# EAGLE design logic_probe-v1.0a (EAGLE 4.15)
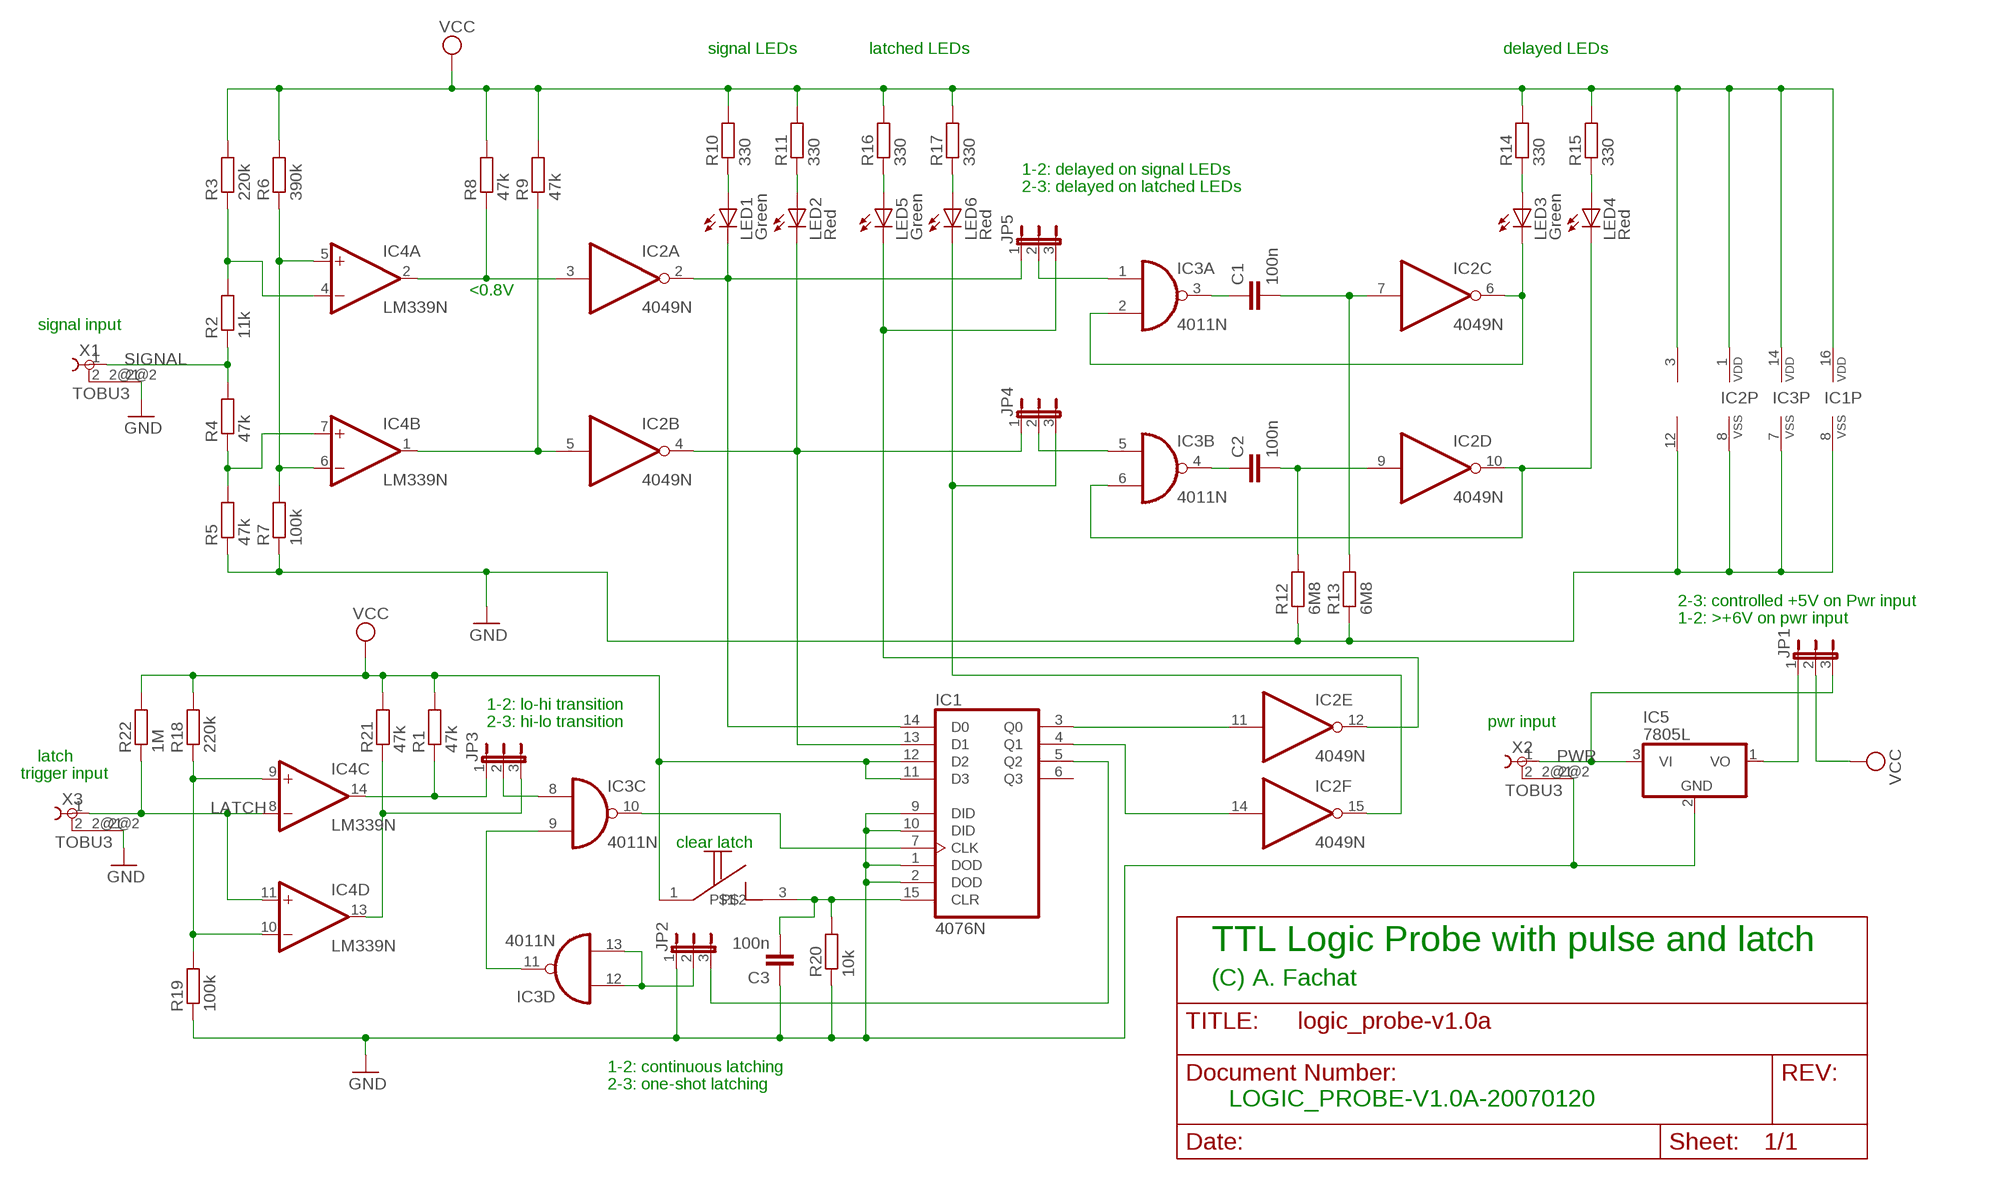
[diagram p0: schematic, sheet 1]

## Parts
C1  100n  C-EU050-025X075  [C050-025X075]
C2  100n  C-EU050-025X075  [C050-025X075]
C3  100n  C-EU050-025X075  [C050-025X075]
IC1  4076N  [DIL16]
IC2  4049N  [DIL16]
IC3  4011N  [DIL14]
IC4  LM339N  [DIL14]
IC5  7805L  [TO92]
JP1  JP2E  [JP2]
JP2  JP2E  [JP2]
JP3  JP2E  [JP2]
JP4  JP2E  [JP2]
JP5  JP2E  [JP2]
LED1  Green  LED3MM  [LED3MM]
LED2  Red  LED3MM  [LED3MM]
LED3  Green  LED3MM  [LED3MM]
LED4  Red  LED3MM  [LED3MM]
LED5  Green  LED3MM  [LED3MM]
LED6  Red  LED3MM  [LED3MM]
R1  47k  R-EU_0207/7  [0207/7]
R2  11k  R-EU_0207/7  [0207/7]
R3  220k  R-EU_0207/7  [0207/7]
R4  47k  R-EU_0207/7  [0207/7]
R5  47k  R-EU_0207/7  [0207/7]
R6  390k  R-EU_0207/7  [0207/7]
R7  100k  R-EU_0207/7  [0207/7]
R8  47k  R-EU_0207/7  [0207/7]
R9  47k  R-EU_0207/7  [0207/7]
R10  330  R-EU_0207/7  [0207/7]
R11  330  R-EU_0207/7  [0207/7]
R12  6M8  R-EU_0207/7  [0207/7]
R13  6M8  R-EU_0207/7  [0207/7]
R14  330  R-EU_0207/7  [0207/7]
R15  330  R-EU_0207/7  [0207/7]
R16  330  R-EU_0207/7  [0207/7]
R17  330  R-EU_0207/7  [0207/7]
R18  220k  R-EU_0207/7  [0207/7]
R19  100k  R-EU_0207/7  [0207/7]
R20  10k  R-EU_0207/7  [0207/7]
R21  47k  R-EU_0207/7  [0207/7]
R22  1M  R-EU_0207/7  [0207/7]
U$3  TASTER  [TASTER]
X1  TOBU3  [TOBU3]
X2  TOBU3  [TOBU3]
X3  TOBU3  [TOBU3]

## Nets
GND: C3.1 IC1.1(DOD) IC1.2(DOD) IC1.8(VSS) IC1.9(DID) IC1.10(DID) IC2.8(P:VSS) IC3.7(P:VSS) IC4.12(P:GND) IC5.2(GND) JP2.1 R5.1 R7.1 R12.1 R13.1 R19.1 R20.1 X1.2@2 X2.2@2 X3.2@2
LATCH: IC4.8(C:-IN) IC4.11(D:+IN) R22.1 X3.1
N$1: C1.2 IC2.7(C:I) R13.2
N$2: IC4.4(A:-IN) R2.2 R3.1
N$4: IC4.7(B:+IN) R4.1 R5.2
N$5: IC4.5(A:+IN) IC4.6(B:-IN) R6.1 R7.2
N$6: C2.2 IC2.9(D:I) R12.2
N$7: IC2.3(A:I) IC4.2(A:OUT) R8.1
N$8: IC2.5(B:I) IC4.1(B:OUT) R9.1
N$9: IC1.14(D0) IC2.2(A:O) JP5.1 LED1.K(C)
N$10: IC1.13(D1) IC2.4(B:O) JP4.1 LED2.K(C)
N$11: LED1.A R10.1
N$12: LED2.A R11.1
N$13: C1.1 IC3.3(A:O)
N$14: C2.1 IC3.4(B:O)
N$15: IC2.6(C:O) IC3.2(A:I1) LED3.K(C)
N$16: IC2.10(D:O) IC3.6(B:I1) LED4.K(C)
N$17: LED3.A R14.1
N$18: LED4.A R15.1
N$19: IC4.13(D:OUT) JP3.3 R21.1
N$20: LED5.A R16.1
N$21: LED6.A R17.1
N$22: IC1.4(Q1) IC2.14(F:I)
N$23: IC2.15(F:O) JP4.3 LED6.K(C)
N$24: IC2.12(E:O) JP5.3 LED5.K(C)
N$25: IC1.3(Q0) IC2.11(E:I)
N$26: IC4.9(C:+IN) IC4.10(D:-IN) R18.1 R19.2
N$28: IC4.14(C:OUT) JP3.1 R1.1
N$29: IC1.7(CLK) IC3.10(C:O)
N$30: IC3.1(A:I0) JP5.2
N$31: C3.2 IC1.15(CLR) R20.2 U$3.3
N$32: IC1.5(Q2) JP2.3
N$33: IC3.12(D:I0) IC3.13(D:I1) JP2.2
N$34: IC3.9(C:I1) IC3.11(D:O)
N$36: IC5.1(VO) JP1.1
N$37: IC3.8(C:I0) JP3.2
N$38: IC3.5(B:I0) JP4.2
PWR: IC5.3(VI) JP1.3 X2.1
SIGNAL: R2.1 R4.2 X1.1
VCC: IC1.11(D3) IC1.12(D2) IC1.16(VDD) IC2.1(P:VDD) IC3.14(P:VDD) IC4.3(P:V+) JP1.2 R1.2 R3.2 R6.2 R8.2 R9.2 R10.2 R11.2 R14.2 R15.2 R16.2 R17.2 R18.2 R21.2 R22.2 U$3.1
Unconnected: IC1.6(Q3) X1.2 X1.2@1 X2.2 X2.2@1 X3.2 X3.2@1

## Notes on the sheet
- signal LEDs | latched LEDs | delayed LEDs
- 1-2: delayed on signal LEDs
- 2-3: delayed on latched LEDs
- <0.8V
- signal input
- 2-3: controlled +5V on Pwr input
- 1-2: >+6V on pwr input
- 1-2: lo-hi transition
- 2-3: hi-lo transition | pwr input
- latch
- trigger input
- clear latch
- TTL Logic Probe with pulse and latch
- (C) A. Fachat
- 1-2: continuous latching
- 2-3: one-shot latching
- LOGIC_PROBE-V1.0A-20070120

## Library data of the parts
C1-C3 = rcl:C-EU: CAPACITOR, European symbol
IC1 = 40xx:4076: Quad D-type REGISTER
IC2 = 40xx:4049: Hex inverting BUFFER
IC3 = 40xx:4011: Quad 2-input NAND
IC4 = linear:LM339: Low Power Low Offset Voltage Quad Comparators with open collector; LM139/LM239/LM339/LM2901/LM3302
IC5 = linear:78*: Positive VOLTAGE REGULATOR Source: http://cache.national.com/ds/LM/LM78L05.pdf http://www.fairchildsemi.com/ds/LM/LM7805.pdf
JP1-JP5 = jumper:JP2E: JUMPER
LED1-LED6 = led:LED: LED OSRAM: - CHIPLED LG R971, LG N971, LY N971, LG Q971, LY Q971, LO R971, LY R971 LH N974, LH R974 LS Q976, LO Q976, LY Q976 LO Q996 - Hyper CHIPLED LW Q18S LB Q993, LB Q99A, LB R99A - SideLED LS A670, LO A670, LY A670, LG A670, LP A670 LB A673, LV A673, LT A673, LW A673 LH A674 LY A675 LS A676, LA A676, LO A676, LY A676, LW A676 LS A679, LY A679, LG A679 - Hyper Micro SIDELED® LS Y876, LA Y876, LO Y876, LY Y876 LT Y87S - SmartLED LW L88C, LW L88S LB L89C, LB L89S, LG L890 LS L89K, LO L89K, LY L89K LS L896, LA L896, LO L896, LY L896 - TOPLED LS T670, LO T670, LY T670, LG T670, LP T670 LSG T670, LSP T670, LSY T670, LOP T670, LYG T670 LG T671, LOG T671, LSG T671 LB T673, LV T673, LT T673, LW T673 LH T674 LS T676, LA T676, LO T676, LY T676, LB T676, LH T676, LSB T676, LW T676 LB T67C, LV T67C, LT T67C, LS T67K, LO T67K, LY T67K, LW E67C LS E67B, LA E67B, LO E67B, LY E67B, LB E67C, LV E67C, LT E67C LW T67C LS T679, LY T679, LG T679 LS T770, LO T770, LY T770, LG T770, LP T770 LB T773, LV T773, LT T773, LW T773 LH T774 LS E675, LA E675, LY E675, LS T675 LS T776, LA T776, LO T776, LY T776, LB T776 LHGB T686 LT T68C, LB T68C - Hyper Mini TOPLED® LB M676 - Mini TOPLED Santana® LG M470 LS M47K, LO M47K, LY M47K Source: http://www.osram.convergy.de/
R1-R22 = rcl:R-EU_: RESISTOR, European symbol
U$3 = csa:TASTER
X1-X3 = con-hirschmann:TOBU3: Female Cinch CONNECTOR

## Board
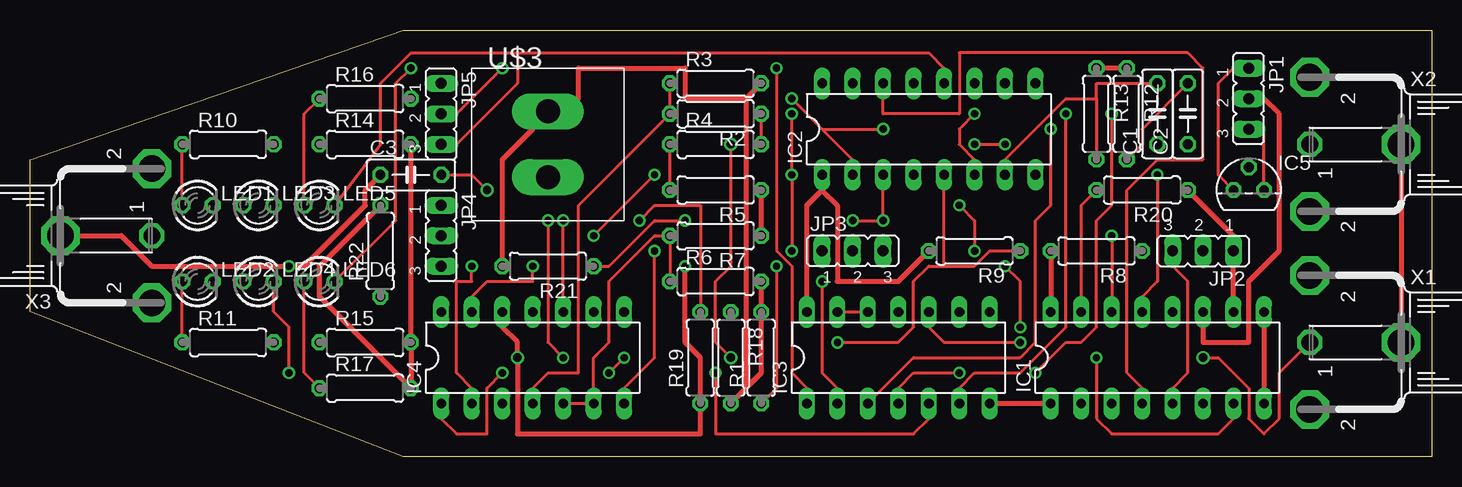
[diagram p1: board, top side]
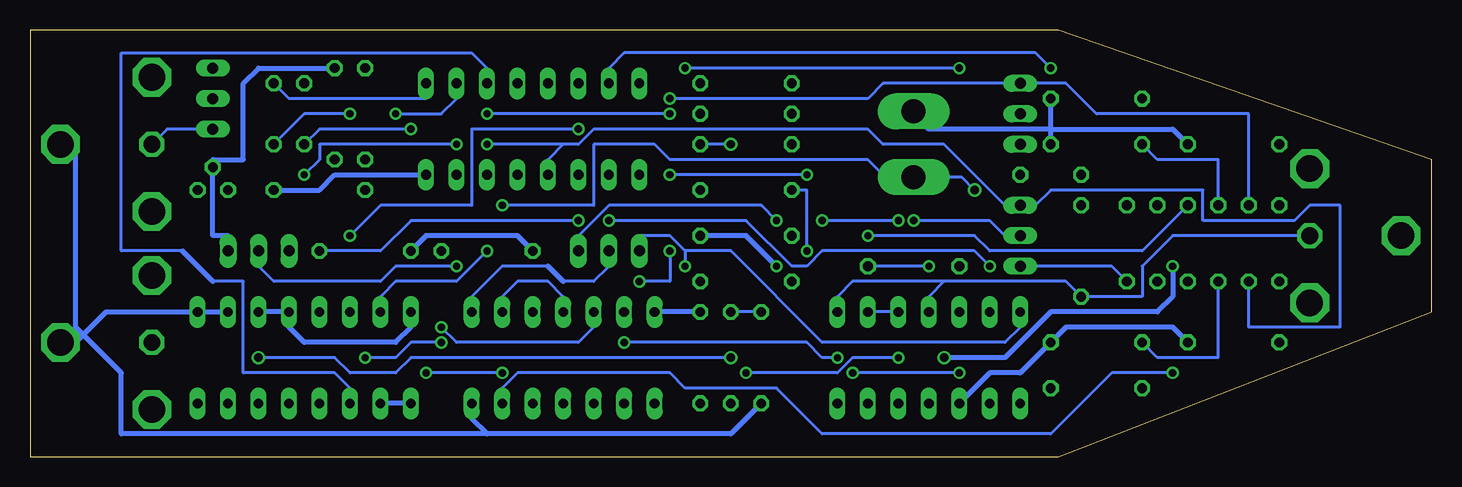
[diagram p2: board, bottom side, seen from below]

Size 116.84 x 35.56 mm. Coordinates in mm from the lower left corner, seen from the top.
Outline: 0,24.77 31.11,35.56 116.84,35.56 116.84,0 31.11,0 0,12.06 0,24.77
Copper layers (1*16): Top 0.035mm / dielectric 1.5mm / Bottom 0.035mm
Design rules "default": minimum track width 10mil, minimum drill 24mil, track to track 8mil, track to pad 8mil, pad to pad 8mil, via to via 8mil, smd to smd 8mil, copper to edge 40mil, drill to drill 8mil, minimum pad ring 10mil, minimum via ring 8mil, stop-mask expansion 4mil, vias tented up to drill 0mil, thermal gap 10mil

### Footprints (pad centres in the part's own frame; a part is rotated, then mirrored left to right if it is on the bottom)
C050-025X075 = drill 0.813 octagon: 1 -2.54,0; 2 2.54,0
DIL16 = drill 0.813 long: 1 -8.89,-3.81; 2 -6.35,-3.81; 3 -3.81,-3.81; 4 -1.27,-3.81; 5 1.27,-3.81; 6 3.81,-3.81; 7 6.35,-3.81; 8 8.89,-3.81; 9 8.89,3.81; 10 6.35,3.81; 11 3.81,3.81; 12 1.27,3.81; 13 -1.27,3.81; 14 -3.81,3.81; 15 -6.35,3.81; 16 -8.89,3.81
DIL14 = drill 0.813 long: 1 -7.62,-3.81; 2 -5.08,-3.81; 3 -2.54,-3.81; 4 0,-3.81; 5 2.54,-3.81; 6 5.08,-3.81; 7 7.62,-3.81; 8 7.62,3.81; 9 5.08,3.81; 10 2.54,3.81; 11 0,3.81; 12 -2.54,3.81; 13 -5.08,3.81; 14 -7.62,3.81
TO92 = drill 0.813 octagon: 1 -1.27,0; 2 0,1.905; 3 1.27,0
JP2 = drill 0.914 long: 1 -2.54,0; 2 0,0; 3 2.54,0
LED3MM = drill 0.813 octagon: A -1.27,0; K 1.27,0
0207/7 = drill 0.813 octagon: 1 -3.81,0; 2 3.81,0
TASTER = drill 2.007 long: 1 0,4.013; 3 0,-1.473
TOBU3 = drill 1.397 octagon: 1 0,-2.54 | drill 2.21 octagon: 2 5.588,-2.54; 2@1 -5.588,-2.54; 2@2 0,5.08

### Placement (x,y rotation side)
C1  93.98,28.58 90 top
C2  96.52,28.58 90 top
C3  31.75,23.5 0 top
IC1  93.98,8.26 0 top
IC2  74.93,27.3 0 top
IC3  72.39,8.26 0 top
IC4  41.91,8.26 0 top
IC5  101.6,22.23 0 top
JP1  101.6,29.84 270 top
JP2  97.79,17.15 180 top
JP3  68.58,17.15 0 top
JP4  34.29,18.41 270 top
JP5  34.29,28.58 270 top
LED1  13.97,20.95 0 top
LED2  13.97,14.6 0 top
LED3  19.05,20.95 0 top
LED4  19.05,14.6 0 top
LED5  24.13,20.95 0 top
LED6  24.13,14.6 0 top
R1  60.96,8.26 90 top
R2  57.15,28.58 180 top
R3  57.15,31.12 0 top
R4  57.15,26.04 0 top
R5  57.15,22.23 180 top
R6  57.15,14.6 0 top
R7  57.15,18.41 180 top
R8  88.9,17.15 180 top
R9  78.74,17.15 180 top
R10  16.51,26.04 0 top
R11  16.51,9.53 0 top
R12  91.44,28.58 270 top
R13  88.9,28.58 270 top
R14  27.94,26.04 0 top
R15  27.94,9.53 0 top
R16  27.94,29.84 0 top
R17  27.94,5.71 0 top
R18  58.42,8.26 270 top
R19  55.88,8.26 90 top
R20  92.71,22.23 180 top
R21  43.18,15.87 180 top
R22  29.21,17.15 90 top
U$3  43.18,24.77 0 top
X1  109.22,9.53 270 top
X2  109.22,26.04 270 top
X3  7.62,18.41 90 top

### Tracks (layer width: path | path; a pad name or v marks a point on that pad's centre or on a via)
GND  (via drill 0.61, 0.7)
  Top 0.254: JP2.1 100.33,18.41
  Top 0.406: IC1.9 IC1.8 | R12.1 R13.1 | 100.33,18.41 R20.1 | IC1.10 JP2.1 | X2.2@2 X1.2@2 | R7.1 R5.1 | IC3.7 IC1.1 | v54.61,15.87 54.61,9.53 55.88,8.26 R19.1 55.88,1.9 40.64,1.9 v40.64,8.26 40.64,9.53 39.37,10.79 IC4.12 | X3.2@2 7.62,18.41 10.16,15.87 v21.59,15.87 22.86,15.87 27.94,20.95 27.94,22.23 C3.1
  Bottom 0.254: IC5.2 101.6,24.77
  Bottom 0.406: IC1.10 IC1.9 110.49,12.06 113.03,9.53 X1.2@2 | IC2.8 91.44,23.5 92.71,22.23 R20.1 | IC5.2 101.6,18.41 100.33,18.41 JP2.1 | R12.1 97.79,32.38 99.06,31.12 99.06,24.77 101.6,24.77 | IC1.1 IC1.2 | R19.1 58.42,1.9 78.74,1.9 | 78.74,1.9 80.01,3.17 IC3.7 | v54.61,15.87 57.15,18.41 R7.1 | 78.74,1.9 109.22,1.9 109.22,6.99 113.03,10.79 113.03,26.04 X2.2@2 | v40.64,8.26 35.56,8.26 31.75,12.06 22.86,12.06 21.59,13.33 v21.59,15.87
LATCH
  Bottom 0.254: 40.64,14.6 30.48,14.6 R22.1 24.13,13.33 24.13,15.87 21.59,18.41 X3.1 | 40.64,14.6 41.91,13.33 IC4.11 | 40.64,14.6 48.26,14.6 49.53,13.33 IC4.8
N$1
  Top 0.254: 88.9,29.84 86.36,29.84 81.28,24.77 IC2.7 | 88.9,29.84 R13.2 | C1.2 88.9,31.12 88.9,29.84
N$2
  Top 0.254: IC4.4 41.91,5.71 43.18,6.99 45.72,6.99 45.72,20.95 R2.2 R3.1
N$4  (via drill 0.61)
  Top 0.254: v52.07,17.15 52.07,8.26 49.53,5.71 IC4.7 | R5.2 R4.1
  Bottom 0.254: v52.07,17.15 52.07,22.23 R5.2
N$5
  Top 0.254: IC4.5 IC4.6 46.99,8.26 48.26,9.53 48.26,14.6 52.07,18.41 R7.2 R6.1
N$6
  Top 0.254: R12.2 92.71,26.04 92.71,27.3 C2.2
  Bottom 0.254: C2.2 95.25,29.84 83.82,29.84 IC2.9
N$7  (via drill 0.61)
  Top 0.254: v36.83,15.87 36.83,14.6 35.56,14.6 35.56,6.99 36.83,5.71 IC4.2 | v68.58,19.69 v71.12,19.69 IC2.3
  Bottom 0.254: v36.83,15.87 38.1,17.15 50.8,17.15 52.07,15.87 53.34,15.87 57.15,19.69 v68.58,19.69 | R8.1 87.63,17.15 85.09,19.69 v71.12,19.69
N$8  (via drill 0.61)
  Top 0.254: v39.37,6.99 38.1,5.71 38.1,1.9 35.56,1.9 34.29,3.17 IC4.1 | v48.26,6.99 v49.53,8.26 | v67.31,9.53 72.39,9.53 73.66,10.79 73.66,14.6 74.93,15.87 76.2,15.87 | 76.2,15.87 IC2.5 | R9.1 80.01,17.15 78.74,15.87 76.2,15.87
  Bottom 0.254: v39.37,6.99 v48.26,6.99 | v49.53,8.26 50.8,8.26 52.07,9.53 v67.31,9.53
N$9  (via drill 0.61)
  Top 0.254: v63.5,29.84 66.04,27.3 | 66.04,27.3 68.58,24.77 IC2.2 | 66.04,27.3 v71.12,27.3 | v90.17,18.41 IC1.14
  Bottom 0.254: LED1.K 15.24,28.58 27.94,28.58 30.48,31.12 JP5.1 45.72,31.12 46.99,29.84 v63.5,29.84 | v90.17,18.41 87.63,20.95 80.01,20.95 80.01,27.3 v71.12,27.3
N$10  (via drill 0.61)
  Top 0.254: v93.98,23.5 93.98,14.6 92.71,13.33 IC1.13 | v78.74,26.04 v81.28,26.04
  Bottom 0.254: LED2.K 15.24,10.79 7.62,10.79 7.62,20.95 10.16,20.95 11.43,19.69 19.05,19.69 19.05,22.23 31.75,22.23 33.02,20.95 JP4.1 35.56,20.95 40.64,26.04 45.72,26.04 46.99,27.3 69.85,27.3 71.12,26.04 72.39,26.04 | 72.39,26.04 73.66,24.77 IC2.4 | v93.98,23.5 92.71,24.77 92.71,26.04 v81.28,26.04 | 72.39,26.04 v78.74,26.04
N$11
  Top 0.254: LED1.A R10.1
N$12
  Top 0.254: R11.1 LED2.A
N$13  (via drill 0.61)
  Top 0.254: v85.09,27.3 85.09,20.95 83.82,19.69 83.82,9.53 82.55,8.26 73.66,8.26 IC3.3
  Bottom 0.254: v85.09,27.3 92.71,27.3 C1.1
N$14  (via drill 0.61)
  Top 0.254: v77.47,6.99 73.66,6.99 72.39,5.71 IC3.4 | v83.82,6.99 86.36,9.53 87.63,9.53 88.9,10.79 88.9,19.69 90.17,20.95 v90.17,28.58
  Bottom 0.254: v77.47,6.99 v83.82,6.99 | v90.17,28.58 93.98,28.58 C2.1
N$15  (via drill 0.61)
  Top 0.254: v46.99,18.41 v52.07,23.5 | v63.5,17.15 v63.5,23.5 v63.5,28.58 | v66.04,14.6 66.04,6.99 67.31,5.71 IC3.2 | v78.74,28.58 77.47,27.3 77.47,26.04 78.74,24.77 IC2.6
  Bottom 0.254: LED3.K 24.13,17.15 36.83,17.15 38.1,18.41 v46.99,18.41 | v52.07,23.5 v63.5,23.5 | v63.5,17.15 63.5,14.6 v66.04,14.6 | v63.5,28.58 v78.74,28.58
N$16  (via drill 0.61)
  Top 0.254: LED4.K 20.32,12.06 21.59,10.79 v21.59,6.99 | v86.36,28.58 86.36,10.79 82.55,6.99 78.74,6.99 77.47,5.71 IC3.6
  Bottom 0.254: v21.59,6.99 26.67,6.99 31.75,1.9 50.8,1.9 54.61,5.71 62.23,5.71 63.5,6.99 76.2,6.99 77.47,5.71 IC3.6 | v86.36,28.58 82.55,28.58 81.28,29.84 IC2.10
N$17
  Bottom 0.254: LED3.A 17.78,24.77 22.86,24.77 R14.1
N$18
  Bottom 0.254: LED4.A 17.78,8.26 22.86,8.26 R15.1
N$19  (via drill 0.61)
  Top 0.254: v41.91,15.87 41.91,14.6 38.1,14.6 36.83,13.33 IC4.13 | v54.61,19.69 52.07,19.69 48.26,15.87 R21.1
  Bottom 0.254: v41.91,15.87 R21.1 | v54.61,19.69 55.88,20.95 68.58,20.95 71.12,18.41 JP3.3
N$20
  Top 0.254: LED5.A 22.86,28.58 R16.1
N$21
  Top 0.254: R17.1 22.86,6.99 LED6.A
N$22
  Top 0.254: IC1.4 92.71,5.71 91.44,6.99 91.44,22.23 93.98,24.77 97.79,24.77 97.79,32.38 96.52,33.66 77.47,33.66 77.47,28.58 71.12,28.58 IC2.14
N$23  (via drill 0.61)
  Top 0.254: v31.75,32.38 30.48,31.12 30.48,19.69 LED6.K
  Bottom 0.254: LED6.K 26.67,15.87 JP4.3 | v31.75,32.38 33.02,33.66 67.31,33.66 68.58,32.38 IC2.15
N$24
  Top 0.254: LED5.K 29.21,26.04 29.21,31.12 31.75,33.66 40.64,33.66 | 40.64,33.66 40.64,31.12 35.56,26.04 JP5.3 | 40.64,33.66 74.93,33.66 76.2,32.38 IC2.12
N$25
  Bottom 0.254: 104.14,17.15 109.22,17.15 109.22,33.66 80.01,33.66 78.74,32.38 IC2.11 | 101.6,14.6 99.06,14.6 99.06,6.99 91.44,6.99 90.17,5.71 IC1.3
  Bottom 0.406: 101.6,14.6 104.14,17.15
N$26  (via drill 0.61)
  Top 0.254: v50.8,19.69 52.07,20.95 55.88,20.95 R19.2 | IC4.10 v44.45,19.69
  Bottom 0.254: IC4.10 IC4.9 | R19.2 R18.1 | v44.45,19.69 v50.8,19.69
N$28  (via drill 0.61)
  Top 0.254: R1.1 62.23,5.71 v62.23,15.87
  Bottom 0.254: 62.23,17.15 58.42,17.15 50.8,9.53 35.56,9.53 34.29,10.79 IC4.14 | 62.23,17.15 63.5,18.41 66.04,18.41 JP3.1 | 62.23,17.15 v62.23,15.87
N$29  (via drill 0.61)
  Top 0.254: v82.55,9.53 76.2,9.53 74.93,10.79 IC3.10 | v88.9,8.26 88.9,3.17 90.17,1.9 99.06,1.9 100.33,3.17 IC1.7
  Bottom 0.254: v82.55,9.53 85.09,9.53 86.36,8.26 v88.9,8.26
N$30  (via drill 0.61)
  Top 0.254: v62.23,32.38 62.23,17.15 63.5,15.87 63.5,6.99 64.77,5.71 IC3.1 | v39.37,32.38 35.56,28.58 JP5.2
  Bottom 0.254: v39.37,32.38 v62.23,32.38
N$31  (via drill 0.61, 0.7)
  Top 0.254: IC1.15 87.63,20.95 R20.2 | v77.47,20.95 78.74,19.69 v78.74,17.15 | v38.1,22.23 36.83,23.5 C3.2
  Bottom 0.254: v77.47,20.95 69.85,20.95 69.85,26.04 64.77,26.04 63.5,24.77 46.99,24.77 45.72,23.5 U$3.3 39.17,23.29 v38.1,22.23 | v78.74,17.15 81.28,14.6 86.36,14.6 87.63,13.33 IC1.15
N$32
  Top 0.254: IC1.5 95.25,5.71 96.52,6.99 96.52,14.6 95.25,15.87 JP2.3
N$33  (via drill 0.61)
  Top 0.254: IC3.13 IC3.12 | v82.55,10.79 82.55,14.6 v81.28,15.87
  Bottom 0.254: v81.28,15.87 86.36,15.87 87.63,14.6 96.52,14.6 97.79,15.87 JP2.2 | v82.55,10.79 81.28,9.53 71.12,9.53 69.85,10.79 IC3.12
N$34
  Bottom 0.254: IC3.11 72.39,13.33 73.66,14.6 76.2,14.6 77.47,13.33 IC3.9
N$36
  Top 0.254: IC5.1 99.06,23.5 99.06,31.12 100.33,32.38 JP1.1
N$37
  Bottom 0.254: 73.66,15.87 77.47,15.87 80.01,13.33 IC3.8 | 72.39,14.6 69.85,14.6 68.58,15.87 JP3.2
  Bottom 0.406: 72.39,14.6 73.66,15.87
N$38  (via drill 0.61)
  Top 0.254: v57.15,6.99 57.15,1.9 73.66,1.9 74.93,3.17 IC3.5 | v44.45,8.26 43.18,9.53 v43.18,19.69
  Bottom 0.254: v57.15,6.99 49.53,6.99 48.26,8.26 v44.45,8.26 | v43.18,19.69 36.83,19.69 35.56,18.41 JP4.2
PWR
  Top 0.254: IC5.3 102.87,27.3 JP1.3
  Bottom 0.254: X2.1 105.41,27.3 JP1.3
SIGNAL  (via drill 0.7)
  Top 0.254: R4.2 R2.1 | v58.42,26.04 58.42,15.87 57.15,14.6 57.15,9.53 v58.42,8.26 | v97.79,8.26 99.06,8.26 101.6,5.71 101.6,3.17 102.87,1.9 104.14,3.17 104.14,6.99 X1.1
  Bottom 0.254: v58.42,26.04 R4.2 | v58.42,8.26 85.09,8.26 86.36,6.99 90.17,6.99 91.44,8.26 v97.79,8.26
VCC
  Top 0.254: U$3.1 41.91,27.3
  Top 0.406: R8.2 IC1.16 | JP1.2 102.87,29.84 104.14,28.58 104.14,17.15 101.6,14.6 101.6,9.53 97.79,9.53 IC1.11 | R22.2 24.13,15.87 24.13,13.33 R17.2 R15.2 R14.2 | 59.69,5.71 60.96,6.99 R1.2 R6.2 | 59.69,5.71 R18.2 | 66.04,22.23 64.77,20.95 IC3.14 | 59.69,29.84 R3.2 | 59.69,29.84 59.69,5.71 | R21.2 39.37,24.77 41.91,27.3 | 59.69,29.84 54.61,29.84 54.61,32.38 45.72,32.38 45.72,29.84 U$3.1 | R9.2 72.39,14.6 67.31,14.6 67.31,20.95 66.04,22.23 | 66.04,22.23 IC2.1
  Bottom 0.406: R9.2 76.2,18.41 83.82,18.41 R8.2 | IC1.11 IC1.12 95.25,10.79 93.98,9.53 86.36,9.53 85.09,10.79 IC1.16 | R11.2 21.59,10.79 30.48,10.79 R15.2 34.29,6.99 36.83,6.99 IC4.3 | R1.2 IC3.14 | R10.2 21.59,27.3 31.75,27.3 | 31.75,27.3 41.91,27.3 U$3.1 | R14.2 31.75,27.3 | 31.75,27.3 R16.2